# EAGLE design FabPOx (EAGLE 6.3)
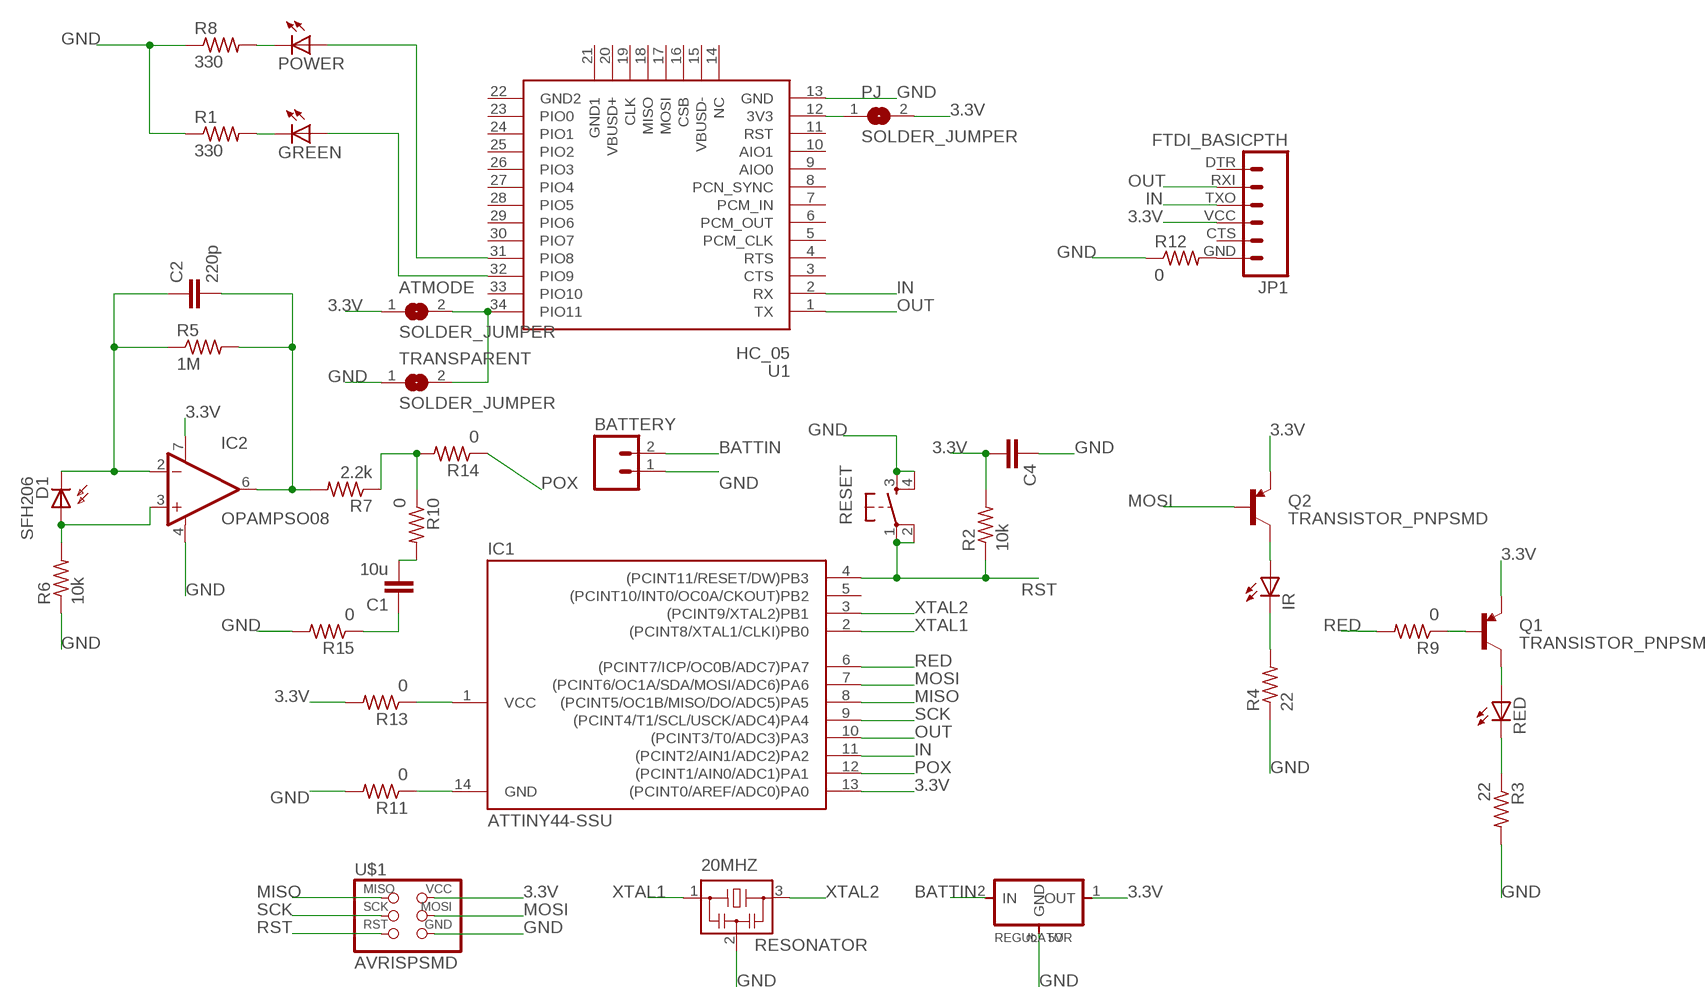
[diagram p0: schematic, sheet 1]

## Parts
20MHZ  RESONATOR  [EFOBM]
ATMODE  SOLDER_JUMPER  [SJFAB]
BATTERY  M02PTH  [1X02]
C1  10u  CAP1206  [1206]
C2  220p  CAP1206  [1206]
C4  CAP1206  [1206]
D1  SFH206  [SFH206]
GREEN  LED1206  [1206]
IC1  ATTINY44-SSU  [SOIC14]
IC2  OPAMPSO08  [SO08]
IR  LED3MM  [LED3MM]
JP1  FTDI_BASICPTH  [FTDI_BASIC]
PJ  SOLDER_JUMPER  [SJFAB]
POWER  LED1206  [1206]
Q1  TRANSISTOR_PNPSMD  [SOT23-3]
Q2  TRANSISTOR_PNPSMD  [SOT23-3]
R1  330  RES-US1206  [R1206]
R2  10k  RES-US1206  [R1206]
R3  22  RES-US1206  [R1206]
R4  22  RES-US1206  [R1206]
R5  1M  RES-US1206  [R1206]
R6  10k  RES-US1206  [R1206]
R7  2.2k  RES-US1206  [R1206]
R8  330  RES-US1206  [R1206]
R9  0  RES-US1206  [R1206]
R10  0  RES-US1206  [R1206]
R11  0  RES-US1206  [R1206]
R12  0  RES-US1206  [R1206]
R13  0  RES-US1206  [R1206]
R14  0  RES-US1206  [R1206]
R15  0  RES-US1206  [R1206]
RED  LED3MM  [LED3MM]
REGULATOR  5V  REGULATORSOT23  [SOT23]
RESET  6MM_SWITCH6MM_SWITCH  [6MM_SWITCH]
TRANSPARENT  SOLDER_JUMPER  [SJFAB]
U1  HC_05  [BLUETOOTH_SMD]
U$1  AVRISPSMD  [2X03SMD]

## Nets
3.3V: ATMODE.1 C4.2 IC1.13((PCINT0/AREF/ADC0)PA0) IC2.7(V+) JP1.VCC PJ.2 Q1.2(E) Q2.2(E) R2.2 R13.2 REGULATOR.1(OUT) U$1.2(VCC)
BATTIN: BATTERY.2 REGULATOR.2(IN)
GND: 20MHZ.2 BATTERY.1 C4.1 IC2.4(V-) IR.K(C) R1.1 R3.1 R3.2 R4.1 R4.2 R6.1 R8.1 R11.2 R12.1 R15.2 RED.K(C) REGULATOR.3(GND) RESET.3(S) RESET.4(S1) TRANSPARENT.1 U1.13(GND) U$1.6(GND)
IN: IC1.11((PCINT2/AIN1/ADC2)PA2) JP1.TXO U1.2(RX)
MISO: IC1.8((PCINT5/OC1B/MISO/DO/ADC5)PA5) U$1.1(MISO)
MOSI: IC1.7((PCINT6/OC1A/SDA/MOSI/ADC6)PA6) Q2.1(B) U$1.4(MOSI)
N$1: Q1.1(B) R9.1
N$2: IR.A Q2.3(C)
N$3: Q1.3(C) RED.A
N$4: R7.1 R10.1 R14.2
N$5: IC1.14(GND) R11.1
N$6: JP1.GND R12.2
N$7: C2.2 IC2.6(OUT) R5.2 R7.2
N$8: C2.1 D1.K(C) IC2.2(-IN) R5.1
N$9: IC1.1(VCC) R13.1
N$10: D1.A IC2.3(+IN) R6.2
N$11: PJ.1 U1.12(3V3)
N$12: C1.2 R10.2
N$13: C1.1 R15.1
N$22: ATMODE.2 TRANSPARENT.2 U1.34(PIO11)
N$23: GREEN.2(C) R1.2
N$24: POWER.2(C) R8.2
N$25: POWER.1(A) U1.31(PIO8)
N$26: GREEN.1(A) U1.32(PIO9)
OUT: IC1.10((PCINT3/T0/ADC3)PA3) JP1.RXI U1.1(TX)
POX: IC1.12((PCINT1/AIN0/ADC1)PA1) R14.1
RED: IC1.6((PCINT7/ICP/OC0B/ADC7)PA7) R9.2
RST: IC1.4((PCINT11/RESET/DW)PB3) R2.1 RESET.1(P) RESET.2(P1) U$1.5(RST)
SCK: IC1.9((PCINT4/T1/SCL/USCK/ADC4)PA4) U$1.3(SCK)
XTAL1: 20MHZ.1 IC1.2((PCINT8/XTAL1/CLKI)PB0)
XTAL2: 20MHZ.3 IC1.3((PCINT9/XTAL2)PB1)
Unconnected: IC1.5((PCINT10/INT0/OC0A/CKOUT)PB2) JP1.CTS JP1.DTR U1.3(CTS) U1.4(RTS) U1.5(PCM_CLK) U1.6(PCM_OUT) U1.7(PCM_IN) U1.8(PCN_SYNC) U1.9(AIO0) U1.10(AIO1) U1.11(RST) U1.14(NC) U1.15(VBUSD-) U1.16(CSB) U1.17(MOSI) U1.18(MISO) U1.19(CLK) U1.20(VBUSD+) U1.21(GND1) U1.22(GND2) U1.23(PIO0) U1.24(PIO1) U1.25(PIO2) U1.26(PIO3) U1.27(PIO4) U1.28(PIO5) U1.29(PIO6) U1.30(PIO7) U1.33(PIO10)

## Library data of the parts
20MHZ = fab:RESONATOR
ATMODE PJ TRANSPARENT = fab:SOLDER_JUMPER
BATTERY = SparkFun-Connectors:M02: Header 2 Standard 2-pin 0.1" header. Use with straight break away headers (SKU : PRT-00116), right angle break away headers (PRT-00553), swiss pins (PRT-00743), machine pins (PRT-00117), and female headers (PRT-00115). Molex polarized connector foot print use with SKU : PRT-08233 with associated crimp pins and housings.
C1 C2 C4 = SparkFun-Capacitors:CAP: Capacitor Standard 0603 ceramic capacitor, and 0.1" leaded capacitor.
D1 = opto-trans-siemens:SFH206: PHOTO DIODE; MPN: SFH206K; OC_FARNELL: 1212741; OC_NEWARK: 01M8807
GREEN POWER = ng:LED
IC1 = fab:ATTINY44
IC2 = ng:OPAMP: Rail-to-Rail Operational Amplifiers Single-Supply, MicroAmplifier(TM) Series
IR RED = SparkFun-LED:LED: LEDs Standard schematic elements and footprints for 5mm, 3mm, 1206, and 0603 sized LEDs. 5mm - Spark Fun Electronics SKU : COM-00529 (and others)
JP1 = SparkFun-Connectors:FTDI_BASIC: FTDI Basic header with labels
Q1 Q2 = SparkFun-DiscreteSemi:TRANSISTOR_PNP: Generic PNP BJT. Double check pinouts against datasheets- not all devices are the same!
R1-R15 = fab:RES-US: Resistor (US Symbol) Variants with postfix FAB are widened to allow the routing of internal traces
REGULATOR = fab:REGULATOR
RESET = fab:6MM_SWITCH: OMRON SWITCH
U1 = SerialPortBluetooth:HC_05
U$1 = fab:AVRISP

## Board
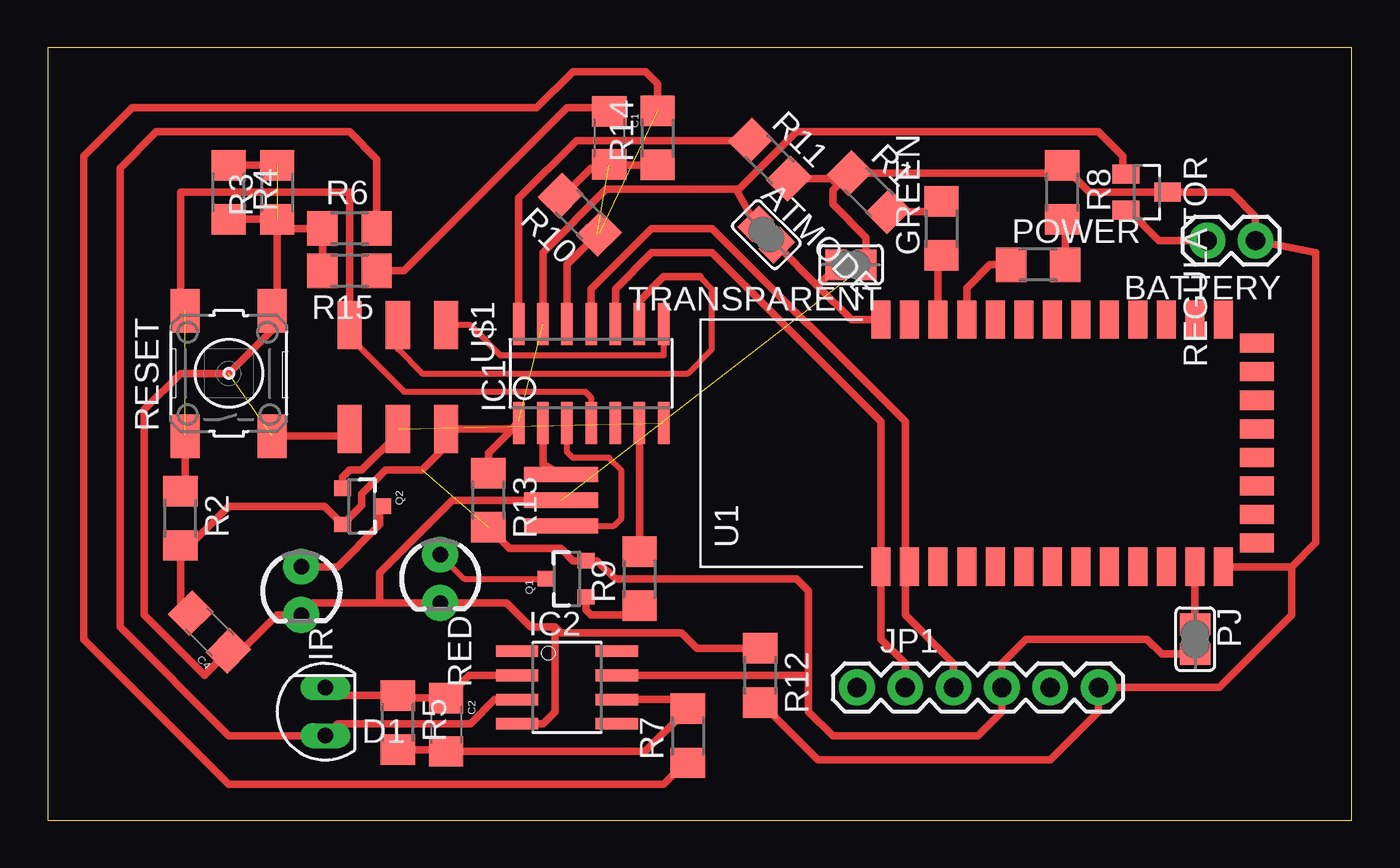
[diagram p1: board, top side]

Size 68.57 x 40.63 mm. Coordinates in mm from the lower left corner, seen from the top.
Outline: 0,0 68.57,0 68.57,40.63 0,40.63 0,0
Copper layers (1*16): Top 0.035mm / dielectric 1.5mm / Bottom 0.035mm
Design rules "default": minimum track width 10mil, minimum drill 24mil, track to track 8mil, track to pad 8mil, pad to pad 8mil, via to via 8mil, smd to smd 8mil, copper to edge 40mil, drill to drill 8mil, minimum pad ring 10mil, minimum via ring 8mil, stop-mask expansion 4mil, vias tented up to drill 0mil, thermal gap 10mil

### Footprints (pad centres in the part's own frame; a part is rotated, then mirrored left to right if it is on the bottom)
EFOBM = smd 0.8 x 3.9: 1 -1.35,0; 2 0,0; 3 1.35,0
SJFAB = smd 1.118 x 1.6: 1 -0.787,0; 2 0.787,0
1X02 = drill 1.016 pad 1.88: 1 0,0; 2 2.54,0
1206 = smd 1.6 x 1.8: 1 -1.4,0; 2 1.4,0
SFH206 = drill 0.813 long: A 0,-1.27; K 0,1.27
1206' = smd 1.6 x 1.803: 1 -1.422,0; 2 1.422,0
SOIC14 = smd 0.61 x 2.21: 1 -3.81,-2.603; 2 -2.54,-2.603; 3 -1.27,-2.603; 4 0,-2.603; 5 1.27,-2.603; 6 2.54,-2.603; 7 3.81,-2.603; 8 3.81,2.603; 9 2.54,2.603; 10 1.27,2.603; 11 0,2.603; 12 -1.27,2.603; 13 -2.54,2.603; 14 -3.81,2.603
SO08 = smd 0.61 x 2.21: 1 -1.905,-2.616; 2 -0.635,-2.616; 3 0.635,-2.616; 4 1.905,-2.616; 5 1.905,2.616; 6 0.635,2.616; 7 -0.635,2.616; 8 -1.905,2.616
LED3MM = drill 0.813 pad 1.88: A -1.27,0; K 1.27,0
FTDI_BASIC = drill 1.016 pad 1.88: CTS 10.16,0; DTR 0,0; GND 12.7,0; RXI 2.54,0; TXO 5.08,0; VCC 7.62,0
SOT23-3 = smd 0.8 x 0.9: 1 -0.95,-1; 2 0.95,-1; 3 0,1.1
R1206 = smd 1.6 x 1.803: 1 -1.422,0; 2 1.422,0
SOT23 = smd 1 x 1.4: 1 -0.95,-1.1; 2 0.95,-1.1; 3 0,1.1
6MM_SWITCH = smd 2.286 x 1.524: 1 -3.302,2.286; 2 3.302,2.286; 3 -3.302,-2.286; 4 3.302,-2.286
BLUETOOTH_SMD = smd 2 x 1: 1 0,0; 2 0,-1.5; 3 0,-3; 4 0,-4.5; 5 0,-6; 6 0,-7.5; 7 0,-9; 8 0,-10.5; 9 0,-12; 10 0,-13.5; 11 0,-15; 12 0,-16.5; 13 0,-18; 22 13,-18; 23 13,-16.5; 24 13,-15; 25 13,-13.5; 26 13,-12; 27 13,-10.5; 28 13,-9; 29 13,-7.5; 30 13,-6; 31 13,-4.5; 32 13,-3; 33 13,-1.5; 34 13,0 | smd 1 x 1.8: 14 1.25,-19.75; 15 2.75,-19.75; 16 4.25,-19.75; 17 5.75,-19.75; 18 7.25,-19.75; 19 8.75,-19.75; 20 10.25,-19.75; 21 11.75,-19.75
2X03SMD = smd 2.54 x 1.27: 1 -2.54,2.54; 2 2.92,2.54; 3 -2.54,0; 4 2.92,0; 5 -2.54,-2.54; 6 2.92,-2.54

### Placement (x,y rotation side)
20MHZ  26.99,16.83 270 top
ATMODE  37.78,30.8 315 top
BATTERY  63.5,30.48 180 top
C1  29.53,35.88 270 top
C2  20.95,5.03 270 top
C4  8.52,9.9 135 top
D1  14.61,5.71 0 top
GREEN  [1206']  46.99,31.11 90 top
IC1  28.57,23.5 0 top
IC2  27.3,6.99 270 top
IR  13.34,12.06 270 top
JP1  42.55,6.99 0 top
PJ  60.33,9.53 270 top
POWER  [1206']  52.07,29.21 0 top
Q1  27.3,12.7 90 top
Q2  16.51,16.51 270 top
R1  43.18,33.02 315 top
R2  6.99,15.88 270 top
R3  12.06,33.02 90 top
R4  9.53,33.02 270 top
R5  18.41,5.13 270 top
R6  15.88,31.11 0 top
R7  33.66,4.45 90 top
R8  53.34,33.02 270 top
R9  31.11,12.7 90 top
R10  27.98,31.84 135 top
R11  37.97,34.74 315 top
R12  37.47,7.62 270 top
R13  23.18,16.83 270 top
R14  32.07,35.88 90 top
R15  15.88,28.89 180 top
RED  20.64,12.7 270 top
REGULATOR  57.78,33.02 270 top
RESET  9.53,23.5 90 top
TRANSPARENT  42.23,29.21 180 top
U1  43.81,13.34 90 top
U$1  18.41,23.5 270 top

### Tracks (layer width: path | path; a pad name or v marks a point on that pad's centre or on a via)
3.3V  (2 unrouted)
  Top 0.406: PJ.2 58.57,8.74 57.78,9.53 51.44,9.53 50.16,8.26 JP1.VCC 50.16,5.71 48.9,4.45 41.27,4.45 40.01,5.71 40.01,7.62 | 40.01,7.62 IC2.7 | C4.2 6.99,11.43 R2.2 7.47,14.45 9.53,16.51 14.56,16.51 Q2.2 16.51,16.56 16.51,17.14 17.78,18.41 19.68,18.41 20.95,19.68 U$1.2 24.39,20.57 24.77,20.95 | IC1.13 26.04,29.84 29.36,33.17 36.2,33.17 | 36.2,33.17 36.35,33.17 39.37,36.2 55.24,36.2 56.52,34.92 56.52,34.14 REGULATOR.1 | ATMODE.1 36.2,33.17 | 40.01,7.62 40.01,12.06 39.37,12.7 29.84,12.7 28.89,13.65 Q1.2 27.62,13.65 26.99,14.29 24.3,14.29 R13.2
BATTIN
  Top 0.406: REGULATOR.2 56.83,32.07 58.42,30.48 BATTERY.2
GND  (3 unrouted)
  Top 0.406: U1.13 65.41,13.34 66.67,14.61 66.67,29.84 BATTERY.1 63.5,31.75 62.23,33.02 REGULATOR.3 54.76,33.02 R8.1 52.92,34.03 R1.1 41.54,33.39 | RESET.3 15.49,20.19 U$1.6 | R3.1 12.06,27.05 RESET.4 11.81,25.78 9.53,23.5 6.99,23.5 5.08,21.59 5.08,10.79 8.26,7.62 8.26,7.65 C4.1 10.18,8.91 12.06,10.79 IR.K 13.97,11.43 17.46,11.43 | R4.2 R3.1 | R4.1 R3.2 | R6.1 12.55,31.11 R3.1 | 14.47,31.09 R6.1 | 17.46,11.43 RED.K 24.13,11.43 25.4,10.16 26.67,10.16 | IC2.4 26.04,5.08 26.67,5.71 26.67,10.16 | 20MHZ.2 21.27,16.83 17.46,13.02 17.46,11.43 | TRANSPARENT.1 43.02,30.64 41.27,32.38 41.27,33.13 41.54,33.39 | R11.2 41.2,33.73 41.54,33.39 | R12.1 34.14,9.04 33.34,9.84 26.99,9.84 26.67,10.16 | R15.2 R6.1
IN
  Top 0.406: JP1.TXO 47.62,8.26 45.09,10.79 45.09,13.11 | 45.09,13.11 U1.2 | 45.09,13.11 45.09,20.95 34.92,31.11 31.75,31.11 28.57,27.94 IC1.11
MISO
  Top 0.305: IC1.8 32.38,24.45 23.81,24.45 22.23,26.04 U$1.1
MOSI  (1 unrouted)
  Top 0.406: U$1.4 18.41,20.32 16.51,18.41 15.88,18.41 15.51,18.05 Q2.1
N$1
  Top 0.406: Q1.1 28.3,11.06 28.57,10.79 30.63,10.79 R9.1
N$2
  Top 0.406: IR.A 15.24,13.34 17.46,15.56 17.46,16.36 Q2.3
N$3
  Top 0.305: RED.A 21.91,12.7 Q1.3
N$4  (1 unrouted)
  Top 0.406: R7.1 33.5,3.02 32.38,1.91 9.53,1.91 1.91,9.53 1.91,34.92 4.45,37.47 25.72,37.47 27.62,39.37 31.43,39.37 32.07,38.73 R14.2
N$5
  Top 0.406: R11.1 27.81,35.74 24.77,32.7 IC1.14
N$6
  Top 0.406: R12.2 40.49,3.17 52.7,3.17 55.24,5.71 JP1.GND 61.59,6.99 65.41,10.79 65.41,13.34
N$7
  Top 0.406: R5.2 20.87,3.71 C2.2 31.41,3.63 R7.2 33.17,6.35 IC2.6
N$8
  Top 0.406: IC2.2 22.15,7.62 C2.1 18.55,6.43 R5.1 15.03,6.56 D1.K
N$9
  Top 0.406: R13.1 23.18,19.3 IC1.1
N$10
  Top 0.406: R6.2 17.3,34.77 15.88,36.2 5.71,36.2 3.81,34.29 3.81,10.16 9.53,4.45 D1.A 15.24,5.08 22.23,5.08 23.5,6.35 IC2.3
N$11
  Top 0.406: PJ.1 60.31,10.31 U1.12
N$12
  Top 0.406: R10.2 27.13,32.85 28.57,34.29 29.34,34.29 C1.2
N$13
  Top 0.406: R15.1 18.73,28.89 27.3,37.47 29.34,37.47 C1.1
N$22
  Top 0.406: U1.34 42.24,26.34 40.48,28.1 | 40.48,28.1 ATMODE.2 | TRANSPARENT.2 41.44,29.06 40.48,28.1
N$23
  Top 0.406: R1.2 46.47,32.01 GREEN.2
N$24
  Top 0.406: POWER.2 53.49,31.45 R8.2
N$25
  Top 0.406: U1.31 48.31,28 49.53,29.21 POWER.1
N$26
  Top 0.406: U1.32 46.81,29.52 GREEN.1
OUT
  Top 0.406: JP1.RXI 45.09,8.26 43.81,9.53 U1.1 43.81,20.95 34.92,29.84 31.75,29.84 29.84,27.94 IC1.10
POX  (1 unrouted)
  Top 0.406: IC1.12 27.3,29.21 28.89,30.8 | R14.1 29.53,34.46 29.53,34.61
RED
  Top 0.406: R9.2 IC1.6
RST  (1 unrouted)
  Top 0.305: 15.88,25.4 18.73,22.54 28.26,22.54 28.57,22.23 IC1.4
  Top 0.406: RESET.2 7.24,27.3 | 7.24,27.3 7.24,27.56 | 7.24,27.3 6.99,27.56 6.99,33.02 15.88,33.02 U$1.5 15.88,25.4 | RESET.1 7.24,17.55 R2.1
SCK
  Top 0.305: U$1.3 18.41,24.77 19.68,23.5 33.66,23.5 34.92,24.77 34.92,27.94 34.29,28.57
  Top 0.406: IC1.9 31.11,27.3 32.38,28.57 34.29,28.57
XTAL1
  Top 0.406: 20MHZ.1 26.04,18.73 IC1.2
XTAL2
  Top 0.305: 20MHZ.3 29.77,15.48 30.16,15.88 30.16,18.41 29.53,19.05 27.62,19.05 27.3,19.37 IC1.3